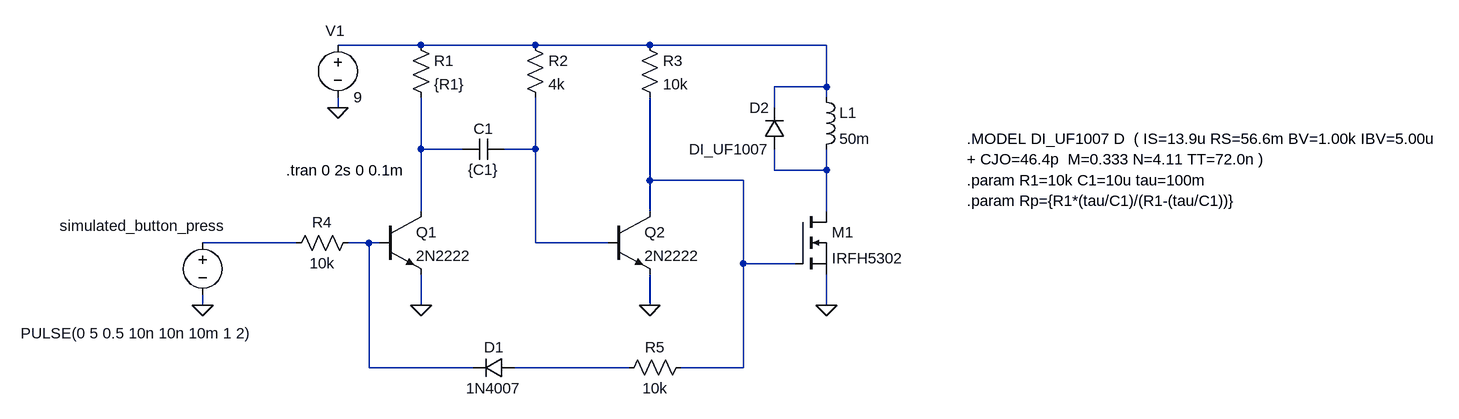
[diagram p0: schematic latching_solenoid_controller.asc]
latching_solenoid_controller.asc, the LTspice schematic file:
Version 4
SHEET 1 1652 740
WIRE 32 64 -96 64
WIRE 208 64 32 64
WIRE 384 64 208 64
WIRE 656 64 384 64
WIRE 656 128 656 64
WIRE 656 128 576 128
WIRE 656 144 656 128
WIRE -96 160 -96 144
WIRE 576 160 576 128
WIRE 32 224 32 144
WIRE 96 224 32 224
WIRE 208 224 208 144
WIRE 208 224 160 224
WIRE 576 256 576 224
WIRE 656 256 656 224
WIRE 656 256 576 256
WIRE 384 272 384 144
WIRE 528 272 384 272
WIRE 32 320 32 224
WIRE 384 320 384 272
WIRE 656 320 656 256
WIRE -160 368 -304 368
WIRE -48 368 -80 368
WIRE -32 368 -48 368
WIRE 208 368 208 224
WIRE 320 368 208 368
WIRE 528 400 528 272
WIRE 608 400 528 400
WIRE -304 464 -304 448
WIRE 32 464 32 416
WIRE 384 464 384 416
WIRE 656 464 656 416
WIRE -48 560 -48 368
WIRE 112 560 -48 560
WIRE 352 560 176 560
WIRE 528 560 528 400
WIRE 528 560 432 560
FLAG 32 464 0
FLAG 384 464 0
FLAG -96 160 0
FLAG -304 464 0
FLAG 656 464 0
SYMBOL res 16 48 R0
SYMATTR InstName R1
SYMATTR Value {R1}
SYMBOL res 192 48 R0
SYMATTR InstName R2
SYMATTR Value 4k
SYMBOL res 368 48 R0
SYMATTR InstName R3
SYMATTR Value 10k
SYMBOL res -64 352 R90
WINDOW 0 0 56 VBottom 2
WINDOW 3 32 56 VTop 2
SYMATTR InstName R4
SYMATTR Value 10k
SYMBOL npn -32 320 R0
SYMATTR InstName Q1
SYMATTR Value 2N2222
SYMBOL npn 320 320 R0
SYMATTR InstName Q2
SYMATTR Value 2N2222
SYMBOL cap 160 208 R90
WINDOW 0 0 32 VBottom 2
WINDOW 3 32 32 VTop 2
SYMATTR InstName C1
SYMATTR Value {C1}
SYMBOL voltage -96 48 R0
WINDOW 123 0 0 Left 0
WINDOW 39 0 0 Left 0
WINDOW 0 -19 -6 Left 2
SYMATTR InstName V1
SYMATTR Value 9
SYMBOL voltage -304 352 R0
WINDOW 123 0 0 Left 0
WINDOW 39 0 0 Left 0
WINDOW 0 -220 -10 Left 2
WINDOW 3 -280 155 Left 2
SYMATTR InstName simulated_button_press
SYMATTR Value PULSE(0 5 0.5 10n 10n 10m 1 2)
SYMBOL nmos 608 320 R0
SYMATTR InstName M1
SYMATTR Value IRFH5302
SYMBOL diode 176 544 R90
WINDOW 0 0 32 VBottom 2
WINDOW 3 32 32 VTop 2
SYMATTR InstName D1
SYMATTR Value 1N4007
SYMBOL res 448 544 R90
WINDOW 0 0 56 VBottom 2
WINDOW 3 32 56 VTop 2
SYMATTR InstName R5
SYMATTR Value 10k
SYMBOL ind 640 128 R0
SYMATTR InstName L1
SYMATTR Value 50m
SYMATTR SpiceLine Rser=10
SYMBOL diode 592 224 R180
WINDOW 0 24 64 Left 2
WINDOW 3 24 0 Left 2
SYMATTR InstName D2
SYMATTR Value DI_UF1007
TEXT 872 272 Left 2 !.param R1=10k C1=10u tau=100m\n.param Rp={R1*(tau/C1)/(R1-(tau/C1))}
TEXT -176 256 Left 2 !.tran 0 2s 0 0.1m
TEXT 872 208 Left 2 !.MODEL DI_UF1007 D  ( IS=13.9u RS=56.6m BV=1.00k IBV=5.00u\n+ CJO=46.4p  M=0.333 N=4.11 TT=72.0n )

The netlist it stands for:
* latching_solenoid_controller.asc
R1 N001 N002 {R1}
R2 N001 N003 4k
R3 N001 N005 10k
R4 N007 N006 10k
Q1 N002 N007 0 0 2N2222
Q2 N005 N003 0 0 2N2222
C1 N003 N002 {C1}
V1 N001 0 9
V§simulated_button_press N006 0 PULSE(0 5 0.5 10n 10n 10m 1 2)
M1 N004 N005 0 0 IRFH5302
D1 N008 N007 1N4007
R5 N005 N008 10k
L1 N001 N004 50m Rser=10
D2 N004 N001 DI_UF1007
.model D D
.lib standard.dio
.model NPN NPN
.model PNP PNP
.lib standard.bjt
.model NMOS NMOS
.model PMOS PMOS
.lib standard.mos
.param R1=10k C1=10u tau=100m
.param Rp={R1*(tau/C1)/(R1-(tau/C1))}
.tran 0 2s 0 0.1m
.MODEL DI_UF1007 D  ( IS=13.9u RS=56.6m BV=1.00k IBV=5.00u
+ CJO=46.4p  M=0.333 N=4.11 TT=72.0n )
.backanno
.end